# Altium project HANC_Digital.PrjPcb
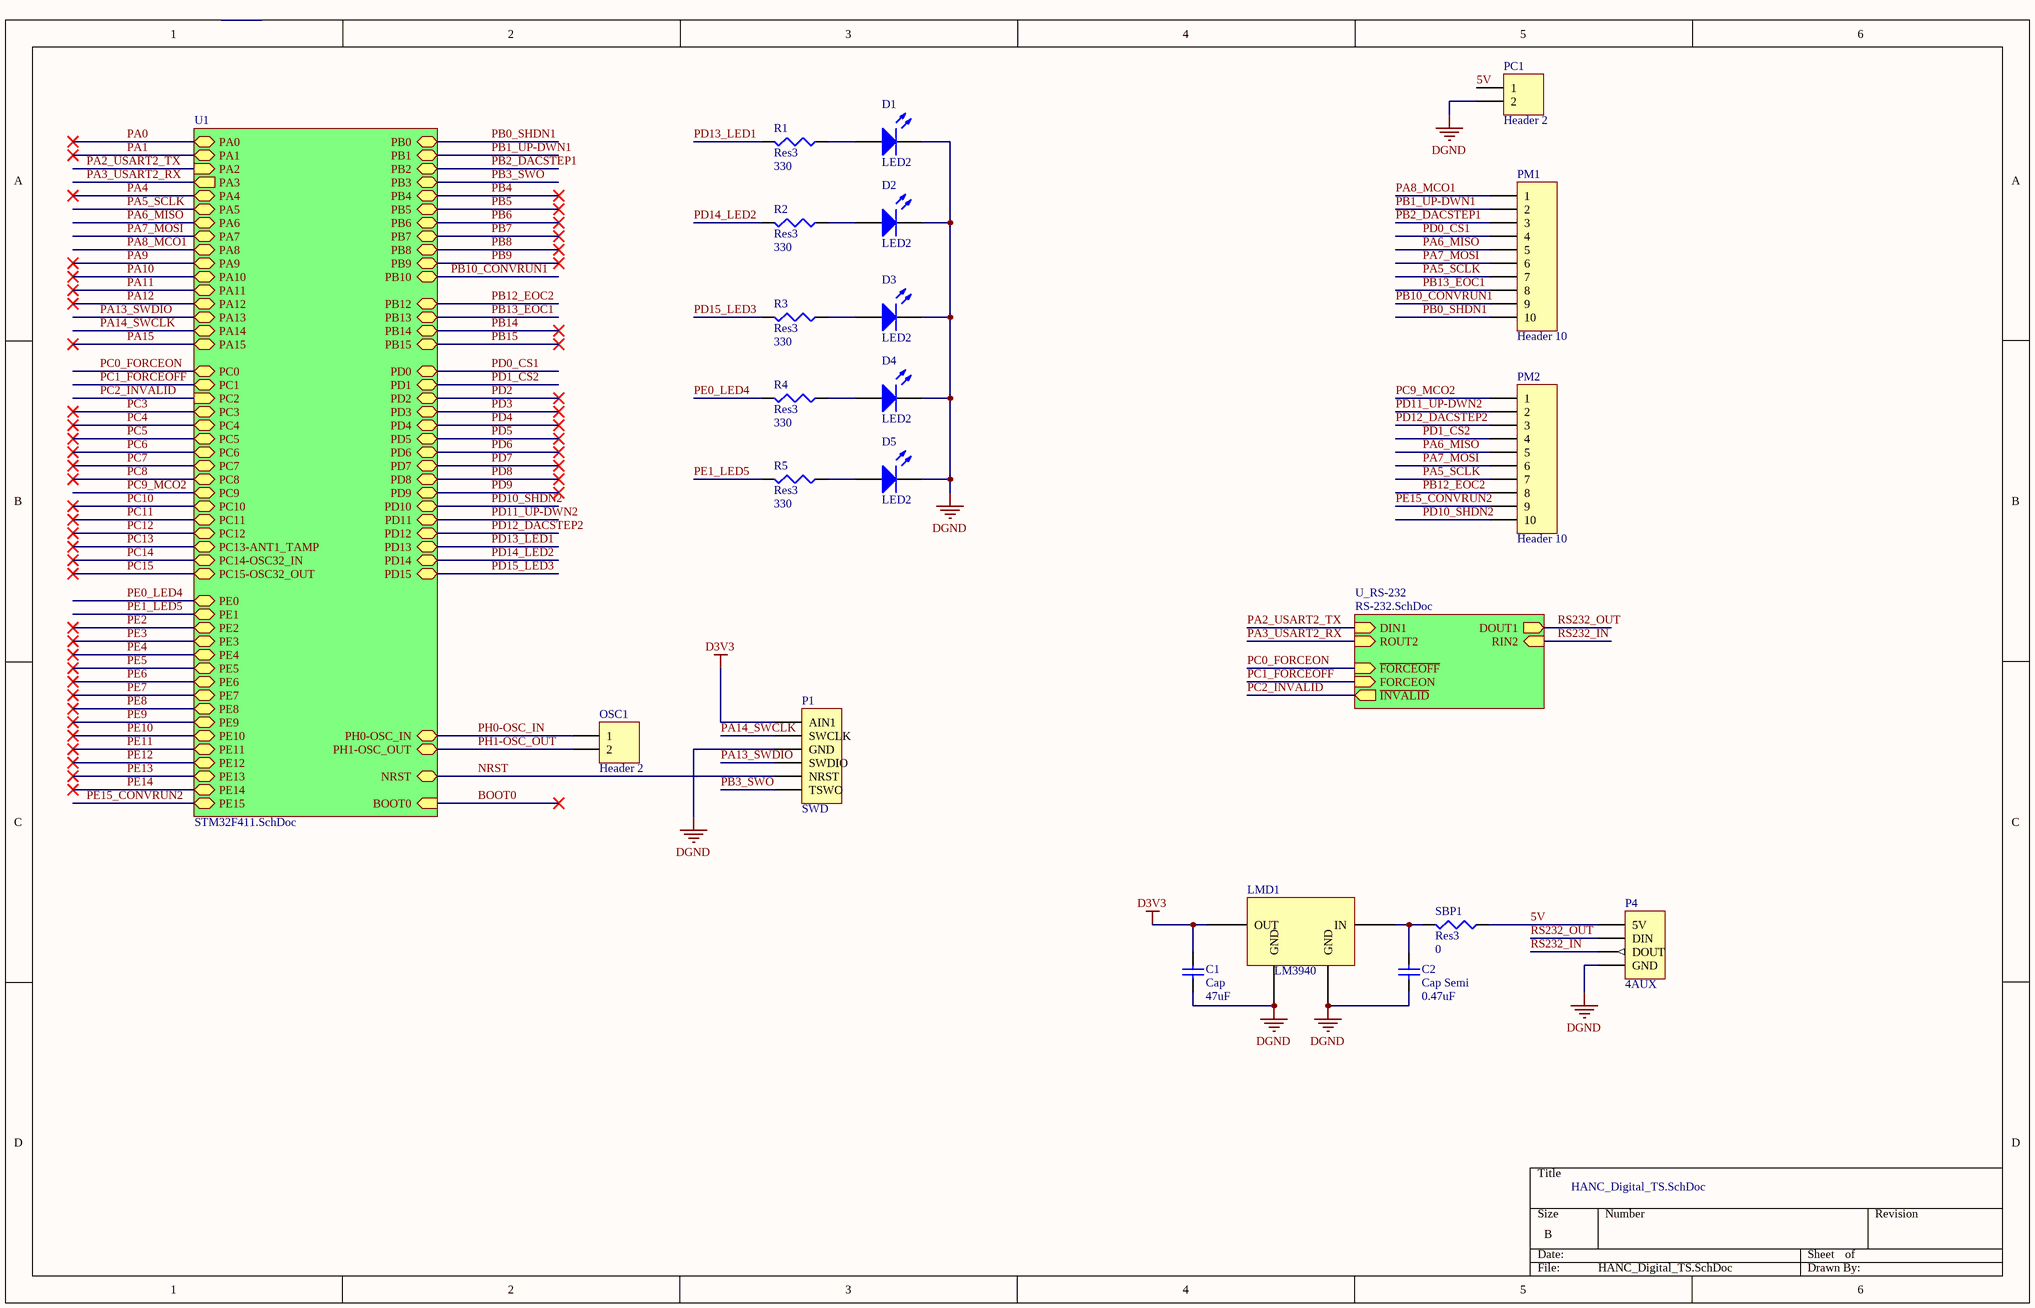
[diagram p0: HANC_Digital_TS.SchDoc]
3 sheets, 57 parts. Net scope: hierarchical (ports join the sheet entries above them; power ports are global).
Board file: HANC_Digital.PcbDoc
Sheets:
  HANC_Digital_TS.SchDoc
    U1 = STM32F411.SchDoc
    U_RS-232 = RS-232.SchDoc

## Sheet HANC_Digital_TS.SchDoc
size B

### Parts
C1  Cap  value 47uF  [1608[0603]]
C2  Cap Semi  value 0.47uF  [1608[0603]]
D1  LED2  [3.2X1.6X1.1]
D2  LED2  [3.2X1.6X1.1]
D3  LED2  [3.2X1.6X1.1]
D4  LED2  [3.2X1.6X1.1]
D5  LED2  [3.2X1.6X1.1]
LMD1  LM3940  [SOT223_N]
OSC1  Header 2  [HDR1X2]
P1  SWD  [HDR1X6]
P4  4AUX  [HDR1X4]
PC1  Header 2  [HDR1X2]
PM1  Header 10  [HDR1X10]
PM2  Header 10  [HDR1X10]
R1  Res3  value 330  [0402]
R2  Res3  value 330  [0402]
R3  Res3  value 330  [0402]
R4  Res3  value 330  [0402]
R5  Res3  value 330  [0402]
SBP1  Res3  value 0  [J1-0603]

### Sub-sheets
U1 = STM32F411.SchDoc: PE2 (bidir), PH0-OSC_IN (bidir), PH1-OSC_OUT (bidir), NRST (bidir), PC0 (bidir), PC1 (bidir), PC2 (in), PC3 (bidir), PE3 (bidir), PA0 (bidir), PA1 (bidir), PA2 (in), PA3 (out), PA4 (bidir), PE4 (bidir), PA5 (bidir), PA6 (bidir), PA7 (bidir), PC4 (bidir), PC5 (bidir), PB0 (bidir), PB1 (bidir), PB2 (bidir), PE7 (bidir), PE8 (bidir), PE5 (bidir), PE9 (bidir), PE10 (bidir), PE11 (bidir), PE12 (bidir), PE13 (bidir), PE14 (bidir), PE15 (bidir), PB10 (bidir), PE6 (bidir), PB12 (bidir), PB13 (bidir), PB14 (bidir), PB15 (bidir), PD8 (bidir), PD9 (bidir), PD10 (bidir), PD11 (bidir), PD12 (bidir), PD13 (bidir), PD14 (bidir), PD15 (bidir), PC6 (bidir), PC7 (bidir), PC8 (bidir), PC9 (bidir), PA8 (bidir), PA9 (bidir), PA10 (bidir), PC13-ANT1_TAMP (bidir), PA11 (bidir), PA12 (bidir), PA13 (bidir), PA14 (bidir), PA15 (bidir), PC10 (bidir), PC11 (bidir), PC14-OSC32_IN (bidir), PC12 (bidir), PD0 (bidir), PD1 (bidir), PD2 (bidir), PD3 (bidir), PD4 (bidir), PD5 (bidir), PD6 (bidir), PD7 (bidir), PB3 (bidir), PC15-OSC32_OUT (bidir), PB4 (bidir), PB5 (bidir), PB6 (bidir), PB7 (bidir), BOOT0, PB8 (bidir), PB9 (bidir), PE0 (bidir), PE1 (bidir)
U_RS-232 = RS-232.SchDoc: DIN1 (in), RIN2 (in), ~{FORCEOFF} (in), FORCEON (in), DOUT1 (out), ROUT2 (in), ~{INVALID} (out)

### Nets
D3V3: C1.2 LMD1.3(OUT) P1.1(AIN1)
DGND: C1.1 C2.1 D1.2(K) D2.2(K) D3.2(K) D4.2(K) D5.2(K) LMD1.2(GND) LMD1.4(GND) P1.3(GND) P4.4(GND) PC1.2
5V: P4.1(5V) PC1.1 SBP1.1
NRST: P1.5(NRST) ; sheet U1/NRST
PA2_USART2_TX: sheet U1/PA2, sheet U_RS-232/DIN1
PA3_USART2_RX: sheet U1/PA3, sheet U_RS-232/ROUT2
PA5_SCLK: PM1.7 PM2.7 ; sheet U1/PA5
PA6_MISO: PM1.5 PM2.5 ; sheet U1/PA6
PA7_MOSI: PM1.6 PM2.6 ; sheet U1/PA7
PA8_MCO1: PM1.1 ; sheet U1/PA8
PA13_SWDIO: P1.4(SWDIO) ; sheet U1/PA13
PA14_SWCLK: P1.2(SWCLK) ; sheet U1/PA14
PB0_SHDN1: PM1.10 ; sheet U1/PB0
PB1_UP-DWN1: PM1.2 ; sheet U1/PB1
PB2_DACSTEP1: PM1.3 ; sheet U1/PB2
PB3_SWO: P1.6(TSWO) ; sheet U1/PB3
PB10_CONVRUN1: PM1.9 ; sheet U1/PB10
PB12_EOC2: PM2.8 ; sheet U1/PB12
PB13_EOC1: PM1.8 ; sheet U1/PB13
PC0_FORCEON: sheet U1/PC0, sheet U_RS-232/~{FORCEOFF}
PC1_FORCEOFF: sheet U1/PC1, sheet U_RS-232/FORCEON
PC2_INVALID: sheet U1/PC2, sheet U_RS-232/~{INVALID}
PC9_MCO2: PM2.1 ; sheet U1/PC9
PD0_CS1: PM1.4 ; sheet U1/PD0
PD1_CS2: PM2.4 ; sheet U1/PD1
PD10_SHDN2: PM2.10 ; sheet U1/PD10
PD11_UP-DWN2: PM2.2 ; sheet U1/PD11
PD12_DACSTEP2: PM2.3 ; sheet U1/PD12
PD13_LED1: R1.2 ; sheet U1/PD13
PD14_LED2: R2.2 ; sheet U1/PD14
PD15_LED3: R3.2 ; sheet U1/PD15
PE0_LED4: R4.2 ; sheet U1/PE0
PE1_LED5: R5.2 ; sheet U1/PE1
PE15_CONVRUN2: PM2.9 ; sheet U1/PE15
PH0-OSC_IN: OSC1.1 ; sheet U1/PH0-OSC_IN
PH1-OSC_OUT: OSC1.2 ; sheet U1/PH1-OSC_OUT
RS232_IN: P4.3(DOUT) ; sheet U_RS-232/RIN2
RS232_OUT: P4.2(DIN) ; sheet U_RS-232/DOUT1
NetC2_2: C2.2 LMD1.1(IN) SBP1.2
NetD1_1: D1.1(A) R1.1
NetD2_1: D2.1(A) R2.1
NetD3_1: D3.1(A) R3.1
NetD4_1: D4.1(A) R4.1
NetD5_1: D5.1(A) R5.1

### Library data of the parts
C1 = Cap Semi: Capacitor (Semiconductor SIM Model); PartNumber: CL10A476MQENRBE; Published: 8-Jun-2000; LatestRevisionDate: 29-May-2009; LatestRevisionNote: IPC-7351 Footprint Added.; PackageReference: C1206; Publisher: Altium Limited; PackageDescription: Chip Capacitor
C2 = Cap Semi: Capacitor (Semiconductor SIM Model); PartNumber: GRM033R60J474KE90D; Published: 8-Jun-2000; LatestRevisionDate: 29-May-2009; LatestRevisionNote: IPC-7351 Footprint Added.; PackageReference: C1206; Publisher: Altium Limited; PackageDescription: Chip Capacitor
D1-D5 = LED2: Typical RED, GREEN, YELLOW, AMBER GaAs LED; PartNumber: LTST-C150CKT; Published: 8-Jun-2000; LatestRevisionDate: 17-Jul-2002; LatestRevisionNote: Re-released for DXP Platform.; PackageVersion: Feb-2002; PackageReference: 3.2X1.6X1.1; Publisher: Altium Limited; PackageDescription: SM LED; 2 Flat Leads
LMD1 = Component_1: PartNumber: LM3940IMP-3.3/NOPB; DatasheetVersion: http://www.ti.com/lit/ds/symlink/lm3940.pdf
OSC1 PC1 = Header 2: Header, 2-Pin; LatestRevisionDate: 17-Jul-2002; LatestRevisionNote: Re-released for DXP Platform.; Publisher: Altium Limited
P1 = Header 6: Header, 6-Pin; LatestRevisionDate: 17-Jul-2002; LatestRevisionNote: Re-released for DXP Platform.; Publisher: Altium Limited
P4 = Header 4: Header, 4-Pin; LatestRevisionDate: 17-Jul-2002; LatestRevisionNote: Re-released for DXP Platform.; Publisher: Altium Limited
PM1 PM2 = Header 10: Header, 10-Pin; LatestRevisionDate: 17-Jul-2002; LatestRevisionNote: Re-released for DXP Platform.; Publisher: Altium Limited
R1-R5 = Res3: Resistor; PartNumber: RC0402FR-07330RL; Published: 8-Jun-2000; LatestRevisionDate: 29-May-2009; LatestRevisionNote: IPC-7351 Footprint Added.; PackageReference: J1-0603; Publisher: Altium Limited; PackageDescription: Chip Resistor
SBP1 = Res3: Resistor; PartNumber: Keystone Electronics 5110; Published: 8-Jun-2000; LatestRevisionDate: 29-May-2009; LatestRevisionNote: IPC-7351 Footprint Added.; PackageReference: J1-0603; Publisher: Altium Limited; PackageDescription: Chip Resistor

## Sheet STM32F411.SchDoc
size B
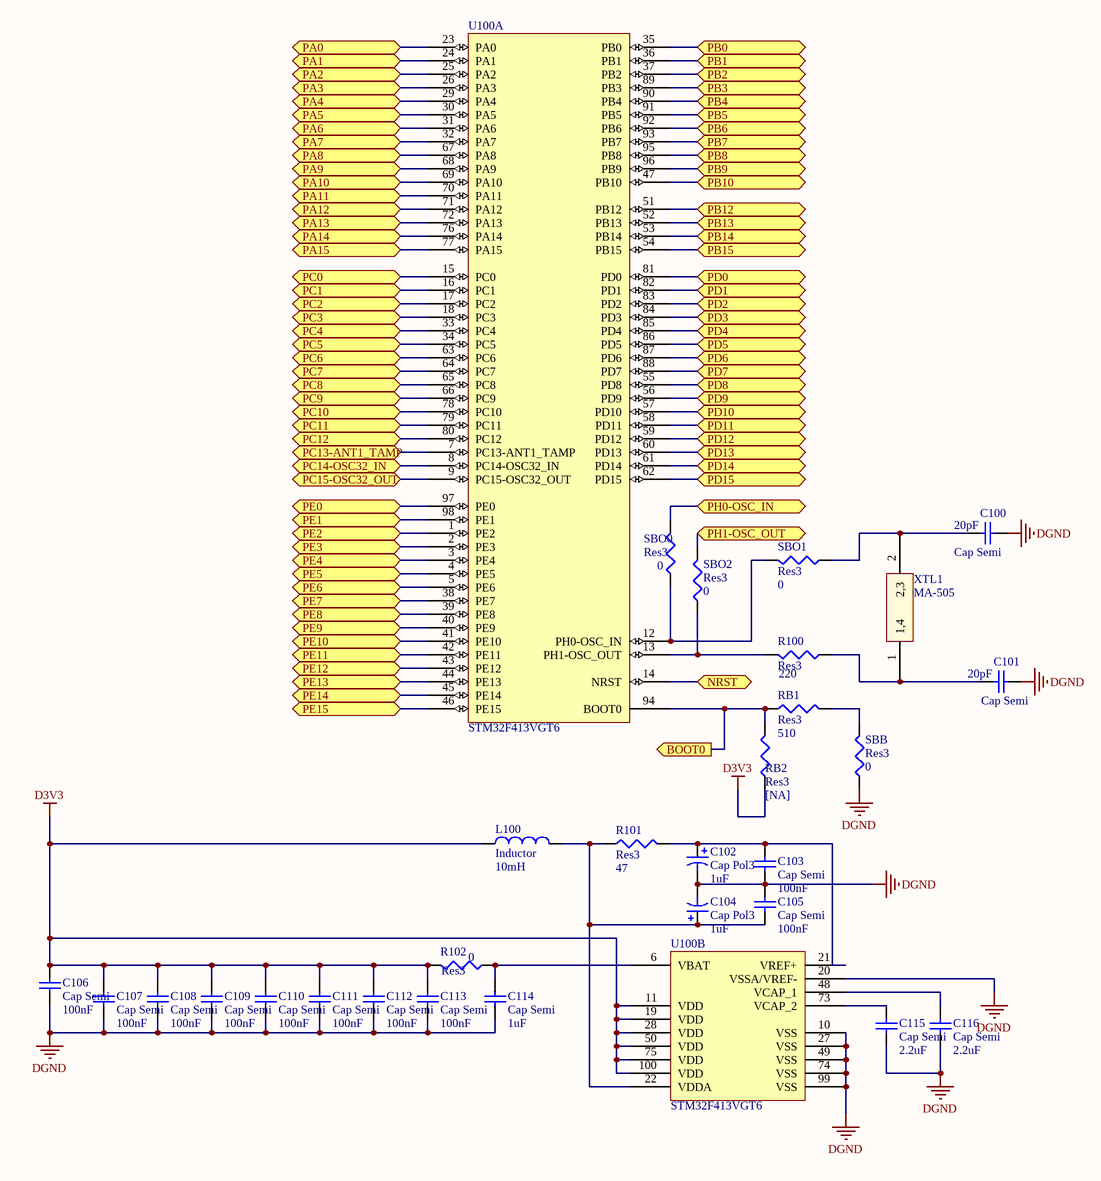
[diagram p1: STM32F411.SchDoc]

### Parts
(Parts that share a designator on the sheet are numbered #1, #2 ... from top to bottom, then left to right.)
C100  Cap Semi  value 20pF  [1608[0603]]
C101  Cap Semi  value 20pF  [1608[0603]]
C102  Cap Pol3  value 1uF  [1608[0603]]
C103  Cap Semi  value 100nF  [0402]
C104  Cap Pol3  value 1uF  [1608[0603]]
C105  Cap Semi  value 100nF  [0402]
C106  Cap Semi  value 100nF  [0402]
C107  Cap Semi  value 100nF  [0402]
C108  Cap Semi  value 100nF  [0402]
C109  Cap Semi  value 100nF  [0402]
C110  Cap Semi  value 100nF  [0402]
C111  Cap Semi  value 100nF  [0402]
C112  Cap Semi  value 100nF  [0402]
C113  Cap Semi  value 100nF  [0402]
C114  Cap Semi  value 1uF  [1608[0603]]
C115  Cap Semi  value 2.2uF  [C1206]
C116  Cap Semi  value 2.2uF  [C1206]
L100  Inductor  value 10mH  [0402C-GENERIC]
R100  Res3  value 220  [J1-0603]
R101  Res3  value 47  [0402]
R102  Res3  value 0  [J1-0603]
RB1  Res3  value 510  [J1-0603]
RB2  Res3  value [NA]  [J1-0603]
SBB  Res3  value 0  [J1-0603]
SBO0  Res3  value 0  [J1-0603]
SBO1  Res3  value 0  [J1-0603]
SBO2  Res3  value 0  [J1-0603]
U100#1  STM32F413VGT6  [STM-LQFP100_V]  (part A of 2)
U100#2  STM32F413VGT6  [STM-LQFP100_V]  (part B of 2)
XTL1  MA-505  [CAPC15256X06N]

### Ports
BOOT0, NRST (bidir), PA0 (bidir), PA1 (bidir), PA2 (bidir), PA3 (bidir), PA4 (bidir), PA5 (bidir), PA6 (bidir), PA7 (bidir), PA8 (bidir), PA9 (bidir), PA10 (bidir), PA11 (bidir), PA12 (bidir), PA13 (bidir), PA14 (bidir), PA15 (bidir), PB0 (bidir), PB1 (bidir), PB2 (bidir), PB3 (bidir), PB4 (bidir), PB5 (bidir), PB6 (bidir), PB7 (bidir), PB8 (bidir), PB9 (bidir), PB10 (bidir), PB12 (bidir), PB13 (bidir), PB14 (bidir), PB15 (bidir), PC0 (bidir), PC1 (bidir), PC2 (bidir), PC3 (bidir), PC4 (bidir), PC5 (bidir), PC6 (bidir), PC7 (bidir), PC8 (bidir), PC9 (bidir), PC10 (bidir), PC11 (bidir), PC12 (bidir), PC13-ANT1_TAMP (bidir), PC14-OSC32_IN (bidir), PC15-OSC32_OUT (bidir), PD0 (bidir), PD1 (bidir), PD2 (bidir), PD3 (bidir), PD4 (bidir), PD5 (bidir), PD6 (bidir), PD7 (bidir), PD8 (bidir), PD9 (bidir), PD10 (bidir), PD11 (bidir), PD12 (bidir), PD13 (bidir), PD14 (bidir), PD15 (bidir), PE0 (bidir), PE1 (bidir), PE2 (bidir), PE3 (bidir), PE4 (bidir), PE5 (bidir), PE6 (bidir), PE7 (bidir), PE8 (bidir), PE9 (bidir), PE10 (bidir), PE11 (bidir), PE12 (bidir), PE13 (bidir), PE14 (bidir), PE15 (bidir), PH0-OSC_IN (bidir), PH1-OSC_OUT (bidir)

### Nets
D3V3: C106.2 C107.2 C108.2 C109.2 C110.2 C111.2 C112.2 C113.2 L100.1 R102.2 RB2.1 U100#2.11(VDD) U100#2.19(VDD) U100#2.28(VDD) U100#2.50(VDD) U100#2.75(VDD) U100#2.100(VDD)
DGND: C100.2 C101.2 C102.2 C103.1 C104.2 C105.2 C106.1 C107.1 C108.1 C109.1 C110.1 C111.1 C112.1 C113.1 C114.1 C115.1 C116.1 SBB.1 U100#2.10(VSS) U100#2.20(VSSA/VREF-) U100#2.27(VSS) U100#2.49(VSS) U100#2.74(VSS) U100#2.99(VSS)
BOOT0: RB1.1 RB2.2 U100#1.94(BOOT0) ; port BOOT0
NRST: U100#1.14(NRST) ; port NRST
PA0: U100#1.23(PA0) ; port PA0
PA1: U100#1.24(PA1) ; port PA1
PA2_USART2_TX: U100#1.25(PA2) ; port PA2
PA3_USART2_RX: U100#1.26(PA3) ; port PA3
PA4: U100#1.29(PA4) ; port PA4
PA5_SCLK: U100#1.30(PA5) ; port PA5
PA6_MISO: U100#1.31(PA6) ; port PA6
PA7_MOSI: U100#1.32(PA7) ; port PA7
PA8_MCO1: U100#1.67(PA8) ; port PA8
PA9: U100#1.68(PA9) ; port PA9
PA10: U100#1.69(PA10) ; port PA10
PA11: U100#1.70(PA11) ; port PA11
PA12: U100#1.71(PA12) ; port PA12
PA13_SWDIO: U100#1.72(PA13) ; port PA13
PA14_SWCLK: U100#1.76(PA14) ; port PA14
PA15: U100#1.77(PA15) ; port PA15
PB0_SHDN1: U100#1.35(PB0) ; port PB0
PB1_UP-DWN1: U100#1.36(PB1) ; port PB1
PB2_DACSTEP1: U100#1.37(PB2) ; port PB2
PB3_SWO: U100#1.89(PB3) ; port PB3
PB4: U100#1.90(PB4) ; port PB4
PB5: U100#1.91(PB5) ; port PB5
PB6: U100#1.92(PB6) ; port PB6
PB7: U100#1.93(PB7) ; port PB7
PB8: U100#1.95(PB8) ; port PB8
PB9: U100#1.96(PB9) ; port PB9
PB10_CONVRUN1: U100#1.47(PB10) ; port PB10
PB12_EOC2: U100#1.51(PB12) ; port PB12
PB13_EOC1: U100#1.52(PB13) ; port PB13
PB14: U100#1.53(PB14) ; port PB14
PB15: U100#1.54(PB15) ; port PB15
PC0_FORCEON: U100#1.15(PC0) ; port PC0
PC1_FORCEOFF: U100#1.16(PC1) ; port PC1
PC2_INVALID: U100#1.17(PC2) ; port PC2
PC3: U100#1.18(PC3) ; port PC3
PC4: U100#1.33(PC4) ; port PC4
PC5: U100#1.34(PC5) ; port PC5
PC6: U100#1.63(PC6) ; port PC6
PC7: U100#1.64(PC7) ; port PC7
PC8: U100#1.65(PC8) ; port PC8
PC9_MCO2: U100#1.66(PC9) ; port PC9
PC10: U100#1.78(PC10) ; port PC10
PC11: U100#1.79(PC11) ; port PC11
PC12: U100#1.80(PC12) ; port PC12
PC13: U100#1.7(PC13-ANT1_TAMP) ; port PC13-ANT1_TAMP
PC14: U100#1.8(PC14-OSC32_IN) ; port PC14-OSC32_IN
PC15: U100#1.9(PC15-OSC32_OUT) ; port PC15-OSC32_OUT
PD0_CS1: U100#1.81(PD0) ; port PD0
PD1_CS2: U100#1.82(PD1) ; port PD1
PD2: U100#1.83(PD2) ; port PD2
PD3: U100#1.84(PD3) ; port PD3
PD4: U100#1.85(PD4) ; port PD4
PD5: U100#1.86(PD5) ; port PD5
PD6: U100#1.87(PD6) ; port PD6
PD7: U100#1.88(PD7) ; port PD7
PD8: U100#1.55(PD8) ; port PD8
PD9: U100#1.56(PD9) ; port PD9
PD10_SHDN2: U100#1.57(PD10) ; port PD10
PD11_UP-DWN2: U100#1.58(PD11) ; port PD11
PD12_DACSTEP2: U100#1.59(PD12) ; port PD12
PD13_LED1: U100#1.60(PD13) ; port PD13
PD14_LED2: U100#1.61(PD14) ; port PD14
PD15_LED3: U100#1.62(PD15) ; port PD15
PE0_LED4: U100#1.97(PE0) ; port PE0
PE1_LED5: U100#1.98(PE1) ; port PE1
PE2: U100#1.1(PE2) ; port PE2
PE3: U100#1.2(PE3) ; port PE3
PE4: U100#1.3(PE4) ; port PE4
PE5: U100#1.4(PE5) ; port PE5
PE6: U100#1.5(PE6) ; port PE6
PE7: U100#1.38(PE7) ; port PE7
PE8: U100#1.39(PE8) ; port PE8
PE9: U100#1.40(PE9) ; port PE9
PE10: U100#1.41(PE10) ; port PE10
PE11: U100#1.42(PE11) ; port PE11
PE12: U100#1.43(PE12) ; port PE12
PE13: U100#1.44(PE13) ; port PE13
PE14: U100#1.45(PE14) ; port PE14
PE15_CONVRUN2: U100#1.46(PE15) ; port PE15
PH0-OSC_IN: SBO0.2 ; port PH0-OSC_IN
PH1-OSC_OUT: SBO2.2 ; port PH1-OSC_OUT
NetC100_1: C100.1 SBO1.1 XTL1.2(2,3)
NetC101_1: C101.1 R100.1 XTL1.1(1,4)
NetC102_1: C102.1 C103.2 R101.2 U100#2.21(VREF+)
NetC104_1: C104.1 C105.1 L100.2 R101.1 U100#2.22(VDDA)
NetC114_2: C114.2 R102.1 U100#2.6(VBAT)
NetC115_2: C115.2 U100#2.73(VCAP_2)
NetC116_2: C116.2 U100#2.48(VCAP_1)
NetR100_2: R100.2 SBO2.1 U100#1.13(PH1-OSC_OUT)
NetRB1_2: RB1.2 SBB.2
NetSBO0_1: SBO0.1 SBO1.2 U100#1.12(PH0-OSC_IN)

### Library data of the parts
C100 C101 = Cap Semi: Capacitor (Semiconductor SIM Model); PartNumber: CC0402JRNPO9BN200; Published: 8-Jun-2000; LatestRevisionDate: 29-May-2009; LatestRevisionNote: IPC-7351 Footprint Added.; PackageReference: C1206; Publisher: Altium Limited; PackageDescription: Chip Capacitor
C102 C104 = Cap Pol3: TACL105K016XTA; Published: 8-Jun-2000; LatestRevisionDate: 29-May-2009; LatestRevisionNote: IPC-7351 Footprint Added.; PackageReference: C0805; Publisher: Altium Limited; PackageDescription: Chip Capacitor; PartNumber: TACL105K016XTA
C103 C105 = Cap Semi: C1005X5R1E103K050BA; Published: 8-Jun-2000; LatestRevisionDate: 29-May-2009; LatestRevisionNote: IPC-7351 Footprint Added.; PackageReference: C1206; Publisher: Altium Limited; PackageDescription: Chip Capacitor; PartNumber: C1005X5R1E103K050BA
C106-C113 = Cap Semi: Capacitor (Semiconductor SIM Model); PartNumber: C1005X5R1E103K050BA; Published: 8-Jun-2000; LatestRevisionDate: 29-May-2009; LatestRevisionNote: IPC-7351 Footprint Added.; PackageReference: C1206; Publisher: Altium Limited; PackageDescription: Chip Capacitor
C114 = Cap Semi: Capacitor (Semiconductor SIM Model); PartNumber: CC0603KRX5R7BB105; Published: 8-Jun-2000; LatestRevisionDate: 29-May-2009; LatestRevisionNote: IPC-7351 Footprint Added.; PackageReference: C1206; Publisher: Altium Limited; PackageDescription: Chip Capacitor
C115 C116 = Cap Semi: Capacitor (Semiconductor SIM Model); PartNumber: CC1206KKX7R7BB225; Published: 8-Jun-2000; LatestRevisionDate: 29-May-2009; LatestRevisionNote: IPC-7351 Footprint Added.; PackageReference: C1206; Publisher: Altium Limited; PackageDescription: Chip Capacitor
L100 = Inductor: PartNumber: LI0402E600R-10; Code_IEC: 1005; Published: 8-Jun-2000; LatestRevisionDate: 29-May-2009; LatestRevisionNote: IPC-7351 Footprint Added.; PackageReference: 0402-A; Publisher: Altium Limited; PackageDescription: Chip Inductor; Code_JEITA: 0402
R100 = Res3: Resistor; PartNumber: RC0402JR-07220RL; Published: 8-Jun-2000; LatestRevisionDate: 29-May-2009; LatestRevisionNote: IPC-7351 Footprint Added.; PackageReference: J1-0603; Publisher: Altium Limited; PackageDescription: Chip Resistor
R101 = Res3: RC0402FR-0747RL; Published: 8-Jun-2000; LatestRevisionDate: 29-May-2009; LatestRevisionNote: IPC-7351 Footprint Added.; PackageReference: J1-0603; Publisher: Altium Limited; PackageDescription: Chip Resistor; PartNumber: RC0402FR-0747RL
R102 SBO1 = Res3: Resistor; PartNumber: RC0402JR-070RL; Published: 8-Jun-2000; LatestRevisionDate: 29-May-2009; LatestRevisionNote: IPC-7351 Footprint Added.; PackageReference: J1-0603; Publisher: Altium Limited; PackageDescription: Chip Resistor
RB1 RB2 SBB = Res3: Resistor; Published: 8-Jun-2000; LatestRevisionDate: 29-May-2009; LatestRevisionNote: IPC-7351 Footprint Added.; PackageReference: J1-0603; Publisher: Altium Limited; PackageDescription: Chip Resistor
SBO0 = Res3: SB PH0; PartNumber: RC0402JR-070RL; Published: 8-Jun-2000; LatestRevisionDate: 29-May-2009; LatestRevisionNote: IPC-7351 Footprint Added.; PackageReference: J1-0603; Publisher: Altium Limited; PackageDescription: Chip Resistor
SBO2 = Res3: SB_PH1; PartNumber: RC0402JR-070RL; Published: 8-Jun-2000; LatestRevisionDate: 29-May-2009; LatestRevisionNote: IPC-7351 Footprint Added.; PackageReference: J1-0603; Publisher: Altium Limited; PackageDescription: Chip Resistor
U100#1 U100#2 = CMP-1771-00004-1: ARM Cortex-M4 32-Bit DSP+FPU, 1024 KB Flash, 82 I/Os, 100-Pin LQFP, -40 to 85 degC, Tray; PartNumber: STM32F411VET6; ComponentLink1URL: http://www.st.com/; PackageDescription: 100-Pin Low Profile Quad Flat Package, Body 14 x 14 mm, Pitch 0.5 mm; Mounting Technology: Surface Mount; PackageReference: LQFP100; ComponentLink1Description: Manufacturer URL; DatasheetVersion: Rev. 1; PartId: 1
XTL1 = MA-505: PartNumber: HC-49S-C20QSA-8.000MHZ

## Sheet RS-232.SchDoc
size A
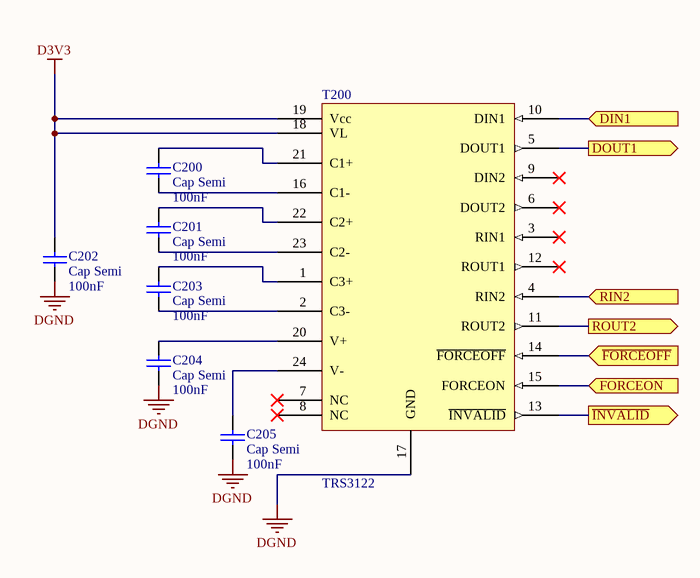
[diagram p2: RS-232.SchDoc]

### Parts
C200  Cap Semi  value 100nF  [1608[0603]]
C201  Cap Semi  value 100nF  [1608[0603]]
C202  Cap Semi  value 100nF  [1608[0603]]
C203  Cap Semi  value 100nF  [1608[0603]]
C204  Cap Semi  value 100nF  [1608[0603]]
C205  Cap Semi  value 100nF  [1608[0603]]
T200  TRS3122  [QFN50P485X485X100_HS-25N]

### Ports
DIN1 (in), DOUT1 (out), FORCEON (in), RIN2 (in), ROUT2 (out), ~{FORCEOFF} (in), ~{INVALID} (out)

### Nets
D3V3: C202.1 T200.18(VL) T200.19(Vcc)
DGND: C202.2 C204.2 C205.2 T200.17(GND)
PA2_USART2_TX: T200.10(DIN1) ; port DIN1
PA3_USART2_RX: T200.11(ROUT2) ; port ROUT2
PC0_FORCEON: T200.14(~{FORCEOFF}) ; port ~{FORCEOFF}
PC1_FORCEOFF: T200.15(FORCEON) ; port FORCEON
PC2_INVALID: T200.13(~{INVALID}) ; port ~{INVALID}
RS232_IN: T200.4(RIN2) ; port RIN2
RS232_OUT: T200.5(DOUT1) ; port DOUT1
NetC200_1: C200.1 T200.21(C1+)
NetC200_2: C200.2 T200.16(C1-)
NetC201_1: C201.1 T200.22(C2+)
NetC201_2: C201.2 T200.23(C2-)
NetC203_1: C203.1 T200.1(C3+)
NetC203_2: C203.2 T200.2(C3-)
NetC204_1: C204.1 T200.20(V+)
NetC205_1: C205.1 T200.24(V-)

Not connected (* = marked no-connect by the designer): T200 3(RIN1)* 6(DOUT2)* 7(NC)* 8(NC)* 9(DIN2)* 12(ROUT1)*

### Library data of the parts
C200-C205 = Cap Semi: Capacitor (Semiconductor SIM Model); PartNumber: CC0603JRX7R7BB104; Published: 8-Jun-2000; LatestRevisionDate: 29-May-2009; LatestRevisionNote: IPC-7351 Footprint Added.; PackageReference: C1206; Publisher: Altium Limited; PackageDescription: Chip Capacitor
  C200: DatasheetVersion: http://www.ti.com/lit/ds/symlink/trs3122e.pdf
T200 = Component_1: PartNumber: TRS3122ERGET

## Nets that join several sheets
D3V3: HANC_Digital_TS (C1.2 LMD1.3 P1.1), STM32F411 (17 pins), RS-232 (C202.1 T200.18 T200.19)
DGND: HANC_Digital_TS (12 pins), STM32F411 (24 pins), RS-232 (C202.2 C204.2 C205.2 T200.17)
NRST: HANC_Digital_TS (P1.5), STM32F411 (U100#1.14)
PA2_USART2_TX: STM32F411 (U100#1.25), RS-232 (T200.10)
PA3_USART2_RX: STM32F411 (U100#1.26), RS-232 (T200.11)
PA5_SCLK: HANC_Digital_TS (PM1.7 PM2.7), STM32F411 (U100#1.30)
PA6_MISO: HANC_Digital_TS (PM1.5 PM2.5), STM32F411 (U100#1.31)
PA7_MOSI: HANC_Digital_TS (PM1.6 PM2.6), STM32F411 (U100#1.32)
PA8_MCO1: HANC_Digital_TS (PM1.1), STM32F411 (U100#1.67)
PA13_SWDIO: HANC_Digital_TS (P1.4), STM32F411 (U100#1.72)
PA14_SWCLK: HANC_Digital_TS (P1.2), STM32F411 (U100#1.76)
PB0_SHDN1: HANC_Digital_TS (PM1.10), STM32F411 (U100#1.35)
PB1_UP-DWN1: HANC_Digital_TS (PM1.2), STM32F411 (U100#1.36)
PB2_DACSTEP1: HANC_Digital_TS (PM1.3), STM32F411 (U100#1.37)
PB3_SWO: HANC_Digital_TS (P1.6), STM32F411 (U100#1.89)
PB10_CONVRUN1: HANC_Digital_TS (PM1.9), STM32F411 (U100#1.47)
PB12_EOC2: HANC_Digital_TS (PM2.8), STM32F411 (U100#1.51)
PB13_EOC1: HANC_Digital_TS (PM1.8), STM32F411 (U100#1.52)
PC0_FORCEON: STM32F411 (U100#1.15), RS-232 (T200.14)
PC1_FORCEOFF: STM32F411 (U100#1.16), RS-232 (T200.15)
PC2_INVALID: STM32F411 (U100#1.17), RS-232 (T200.13)
PC9_MCO2: HANC_Digital_TS (PM2.1), STM32F411 (U100#1.66)
PD0_CS1: HANC_Digital_TS (PM1.4), STM32F411 (U100#1.81)
PD1_CS2: HANC_Digital_TS (PM2.4), STM32F411 (U100#1.82)
PD10_SHDN2: HANC_Digital_TS (PM2.10), STM32F411 (U100#1.57)
PD11_UP-DWN2: HANC_Digital_TS (PM2.2), STM32F411 (U100#1.58)
PD12_DACSTEP2: HANC_Digital_TS (PM2.3), STM32F411 (U100#1.59)
PD13_LED1: HANC_Digital_TS (R1.2), STM32F411 (U100#1.60)
PD14_LED2: HANC_Digital_TS (R2.2), STM32F411 (U100#1.61)
PD15_LED3: HANC_Digital_TS (R3.2), STM32F411 (U100#1.62)
PE0_LED4: HANC_Digital_TS (R4.2), STM32F411 (U100#1.97)
PE1_LED5: HANC_Digital_TS (R5.2), STM32F411 (U100#1.98)
PE15_CONVRUN2: HANC_Digital_TS (PM2.9), STM32F411 (U100#1.46)
PH0-OSC_IN: HANC_Digital_TS (OSC1.1), STM32F411 (SBO0.2)
PH1-OSC_OUT: HANC_Digital_TS (OSC1.2), STM32F411 (SBO2.2)
RS232_IN: HANC_Digital_TS (P4.3), RS-232 (T200.4)
RS232_OUT: HANC_Digital_TS (P4.2), RS-232 (T200.5)